# EAGLE schematic NU32 (EAGLE 5.12)
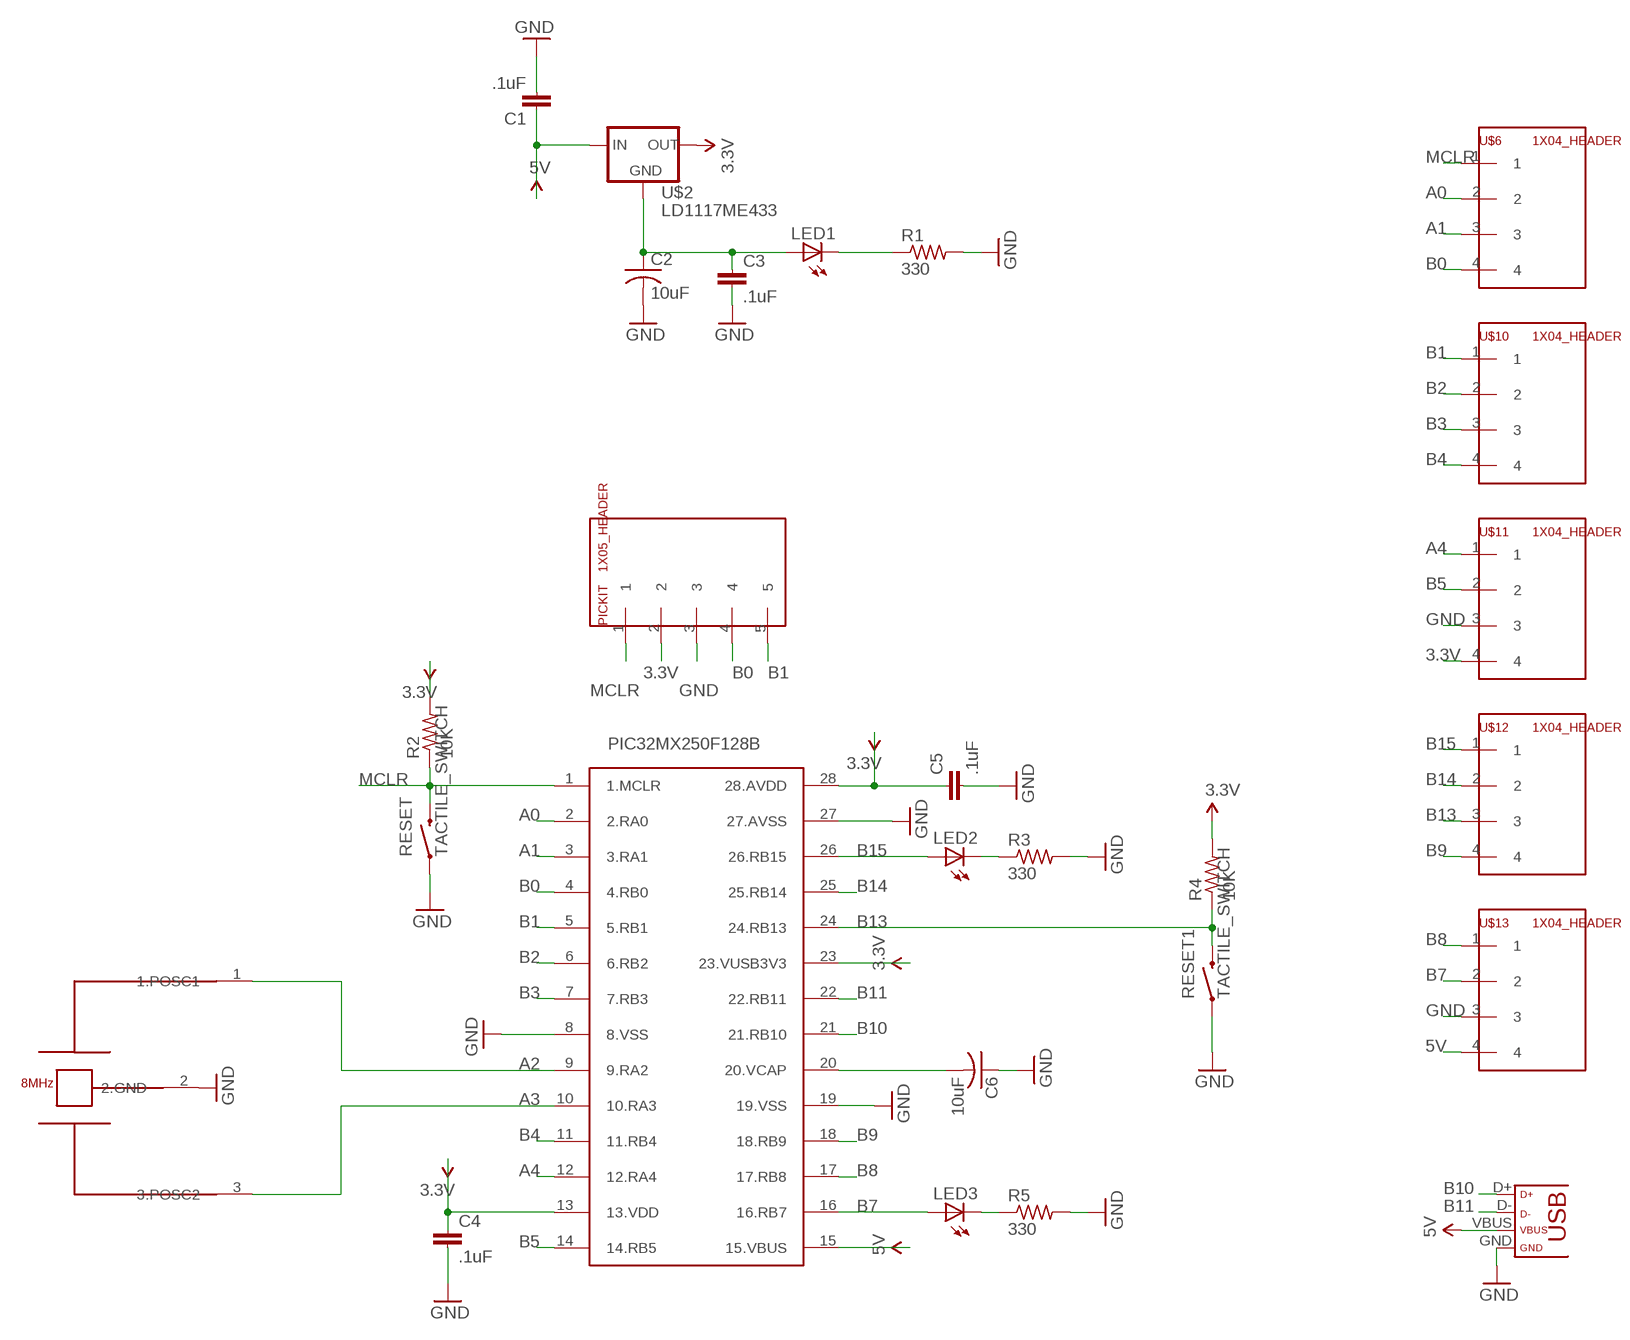
[diagram p0: schematic, sheet 1]

## Parts
C1  .1uF  CAP0603  [0603]
C2  10uF  C-USC0603  [C0603]
C3  .1uF  CAP0603  [0603]
C4  .1uF  CAP0603  [0603]
C5  .1uF  CAP0603  [0603]
C6  10uF  C-USC0603  [C0603]
LED1  LED0603  [0603-DIODE]
LED2  LED0603  [0603-DIODE]
LED3  LED0603  [0603-DIODE]
PICKIT  1X05_HEADER  [1X05]
R1  330  R-US_R0603  [R0603]
R2  10K  R-US_R0603  [R0603]
R3  330  R-US_R0603  [R0603]
R4  10K  R-US_R0603  [R0603]
R5  330  R-US_R0603  [R0603]
RESET  TACTILE_SWITCH  [TACTILE_SWITCH]
RESET1  TACTILE_SWITCH  [TACTILE_SWITCH]
U$1  PIC32MX250F128B  [SOCKET-28-3]
U$2  LD1117ME433  [SOT223]
U$5  USB  [USB-MINIB]
U$6  1X04_HEADER  [1X04]
U$7  8MHZ-RESONATOR  [RESONATOR-PTH]
U$10  1X04_HEADER  [1X04]
U$11  1X04_HEADER  [1X04]
U$12  1X04_HEADER  [1X04]
U$13  1X04_HEADER  [1X04]

## Nets
3.3V: C4.1 C5.1 PICKIT.2 R2.2 R4.2 U$1.13(13.VDD) U$1.23(23.VUSB3V3) U$1.28(28.AVDD) U$2.4(OUT) U$11.4
5V: C1.1 U$1.15(15.VBUS) U$2.3(IN) U$5.VBUS U$13.4
A0: U$1.2(2.RA0) U$6.2
A1: U$1.3(3.RA1) U$6.3
A2: U$1.9(9.RA2) U$7.1(1.POSC1)
A3: U$1.10(10.RA3) U$7.3(3.POSC2)
A4: U$1.12(12.RA4) U$11.1
B0: PICKIT.4 U$1.4(4.RB0) U$6.4
B1: PICKIT.5 U$1.5(5.RB1) U$10.1
B2: U$1.6(6.RB2) U$10.2
B3: U$1.7(7.RB3) U$10.3
B4: U$1.11(11.RB4) U$10.4
B5: U$1.14(14.RB5) U$11.2
B7: LED3.AN(A) U$1.16(16.RB7) U$13.2
B8: U$1.17(17.RB8) U$13.1
B9: U$1.18(18.RB9) U$12.4
B10: U$1.21(21.RB10) U$5.D+
B11: U$1.22(22.RB11) U$5.D-
B13: R4.1 RESET1.2 U$1.24(24.RB13) U$12.3
B14: U$1.25(25.RB14) U$12.2
B15: LED2.AN(A) U$1.26(26.RB15) U$12.1
GND: C1.2 C2.2 C3.2 C4.2 C5.2 C6.1 PICKIT.3 R1.2 R3.2 R5.2 RESET1.1 RESET.1 U$1.8(8.VSS) U$1.19(19.VSS) U$1.27(27.AVSS) U$5.GND U$7.2(2.GND) U$11.3 U$13.3
MCLR: PICKIT.1 R2.1 RESET.2 U$1.1(1.MCLR) U$6.1
N$1: C2.1 C3.1 LED1.AN(A) U$2.1(GND)
N$2: LED1.CAT(C) R1.1
N$3: LED2.CAT(C) R3.1
N$4: LED3.CAT(C) R5.1
N$5: C6.2 U$1.20(20.VCAP)

## Library data of the parts
C1 C3-C5 = VMartinez433:CAP: Capacitor Standard 0603 ceramic capacitor, and 0.1" leaded capacitor.
C2 C6 = VMartinez433:C-US: CAPACITOR, American symbol
LED1-LED3 = VMartinez433:LED: LEDs Standard schematic elements and footprints for 5mm, 3mm, 1206, and 0603 sized LEDs. 5mm - Spark Fun Electronics SKU : COM-00529 (and others)
PICKIT = ME433:1X05_HEADER
R1-R5 = VMartinez433:R-US_: RESISTOR, American symbol
RESET RESET1 = VMartinez433:TACTILE_SWITCH
U$1 = VMartinez433:PIC32MX250F128B
U$2 = VMartinez433:LD1117
U$5 = VMartinez433:USB
U$6 U$10-U$13 = ME433:1X04_HEADER
U$7 = VMartinez433:8MHZ-RESONATOR